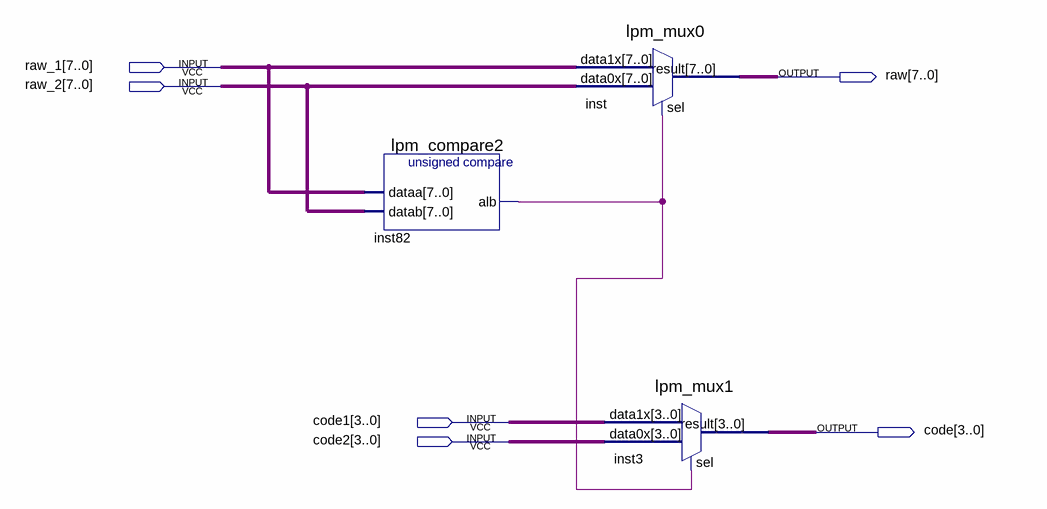
[diagram p0: schematic sheet]
// Quartus schematic min2.bdf as structural Verilog: 3 symbols, 6 pins
module min2 (
  input  [7:0] raw_1,
  input  [7:0] raw_2,
  input  [3:0] code1,
  input  [3:0] code2,
  output [7:0] raw,
  output [3:0] code
);

  wire inst82_alb;

  lpm_compare2 inst82 (.dataa(raw_1), .datab(raw_2), .alb(inst82_alb));
  lpm_mux0 inst (.data1x(raw_1), .data0x(raw_2), .sel(inst82_alb), .result(raw));
  lpm_mux1 inst3 (.data1x(code1), .data0x(code2), .sel(inst82_alb), .result(code));
endmodule
